# EAGLE design Yukari (EAGLE 6.2)
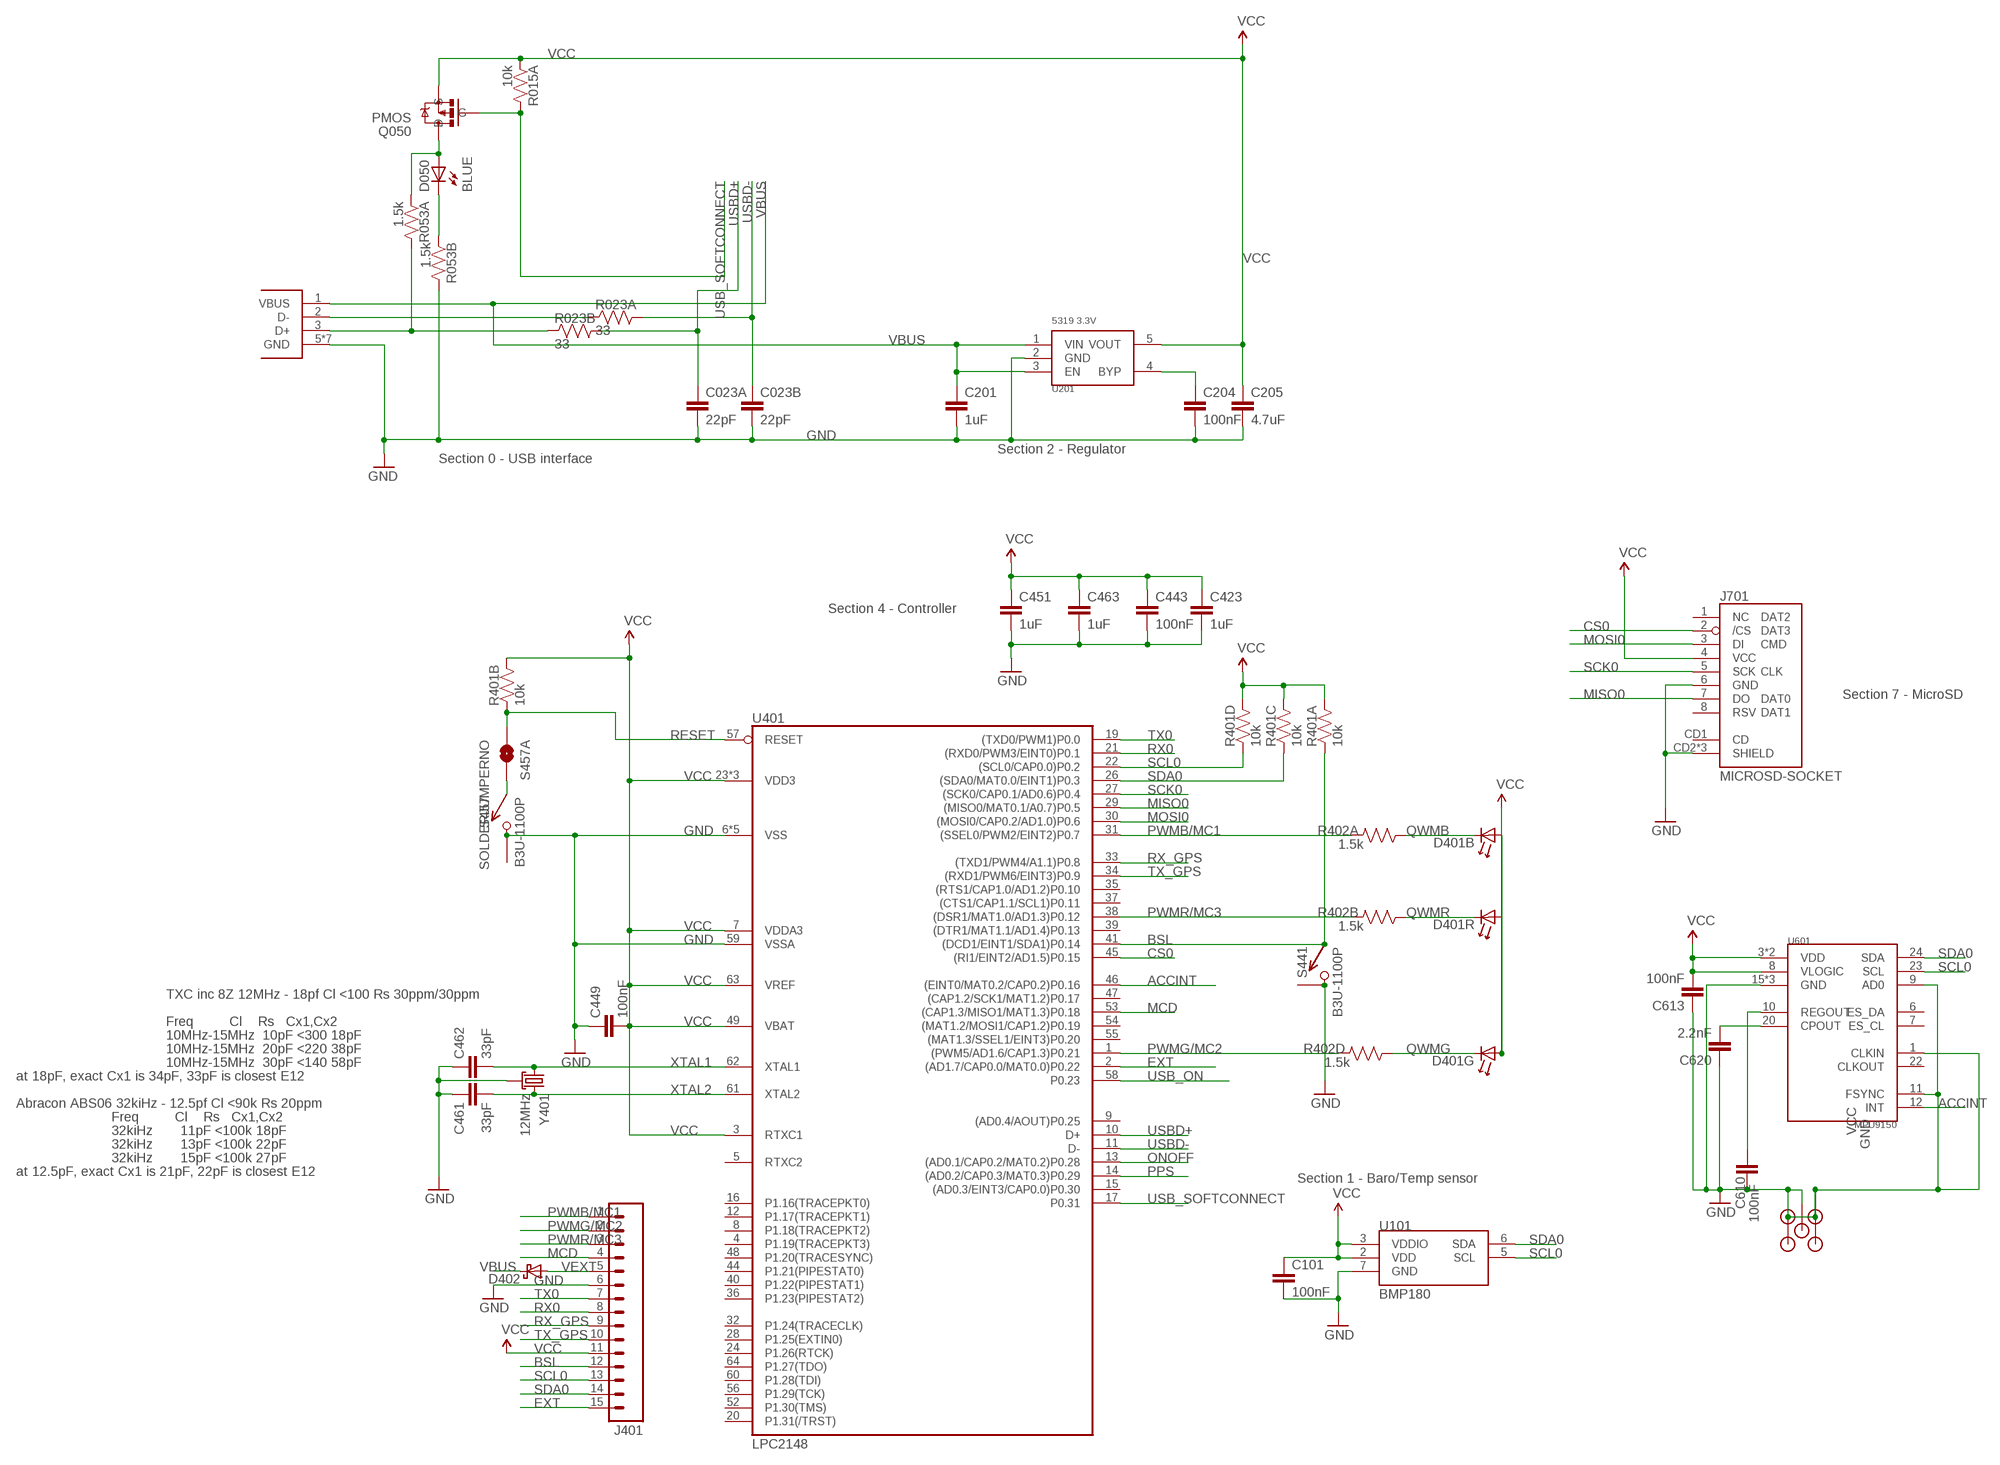
[diagram p0: schematic, sheet 1, part 1 of 2]
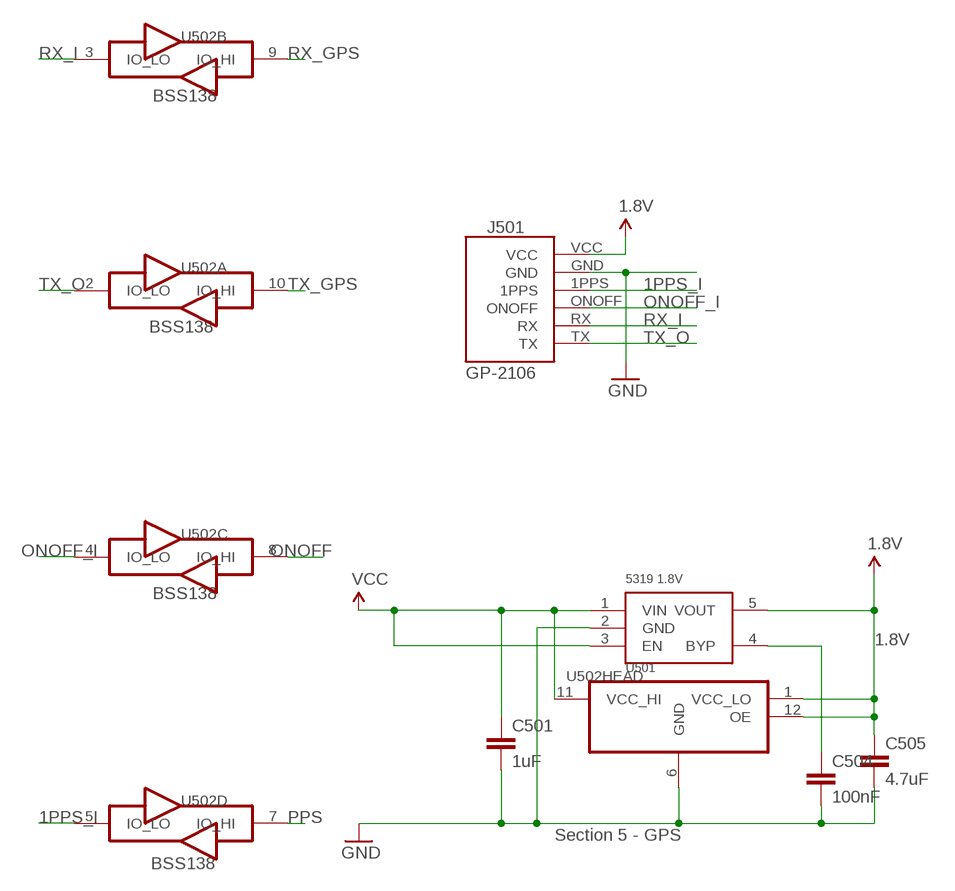
[diagram p1: schematic, sheet 1, part 2 of 2]

## Parts
C023  22pF  CKCM25  [CKCM25]
C101  100nF  CAP0402-CAP  [0402-CAP]
C201  1uF  CAP0402-CAP  [0402-CAP]
C204  100nF  CAP0402-CAP  [0402-CAP]
C205  4.7uF  CAP0402-CAP  [0402-CAP]
C423  1uF  CAP0402-CAP  [0402-CAP]
C443  100nF  CAP0402-CAP  [0402-CAP]
C449  100nF  CAP0402-CAP  [0402-CAP]
C451  1uF  CAP0402-CAP  [0402-CAP]
C461  33pF  CAP0402-CAP  [0402-CAP]
C462  33pF  CAP0402-CAP  [0402-CAP]
C463  1uF  CAP0402-CAP  [0402-CAP]
C501  1uF  CAP0402-CAP  [0402-CAP]
C504  100nF  CAP0402-CAP  [0402-CAP]
C505  4.7uF  CAP0402-CAP  [0402-CAP]
C610  100nF  CAP0402-CAP  [0402-CAP]
C613  100nF  CAP0402-CAP  [0402-CAP]
C620  2.2nF  CAP0402-CAP  [0402-CAP]
D050  BLUE  LED0603  [LED-0603]
D401  SMLP36RGB2W(R)  [SMLP36]
D402  DIODE_SCHOTTKY  [D0603]
J001  USB_MICROB_JSTGCT  [USB_MICROB_3075]
J401  M15  [1X15]
J501  GP-2106  [GP-2106]
J701  MICROSD-SOCKET  [MICROSD-SOCKET-PP]
JP1  STANDOFF  [STANDOFF]
JP2  STANDOFF  [STANDOFF]
JP3  STANDOFF  [STANDOFF]
JP4  STANDOFF  [STANDOFF]
JP5  STANDOFF  [STANDOFF]
Q050  PMOS  MOSFET_PCHANNELSC70  [SC-70-3]
R015  10k  RP2EXB24V  [CRA02]
R023  33  RP2EXB24V  [CRA02]
R053  1.5k  RP2EXB24V  [CRA02]
R401  10k  RP404  [CRA04]
R402  1.5k  RP404  [CRA04]
S441  B3U-1100P  [B3U-1100P]
S457  B3U-1100P  [B3U-1100P]
S457A  SOLDERJUMPERNO  [SJ_2S-NO]
U101  BMP180  [BMP180]
U201  5319 3.3V  MIC5319D5  [SOT-23-5]
U401  LPC2148  [LQFP64]
U501  5319 1.8V  MIC5319D5  [SOT-23-5]
U502  TXB0104RUT  [R-PUQFN-N12]
U601  MPU9150  [LLGA24]
Y401  12MHz  CX2520  [CRYSTAL_SMD_2MM_2_5MM]

## Nets
1.8V: C505.1 J501.VCC U501.5(VOUT) U502.1(HEAD:VCC_LO) U502.12(HEAD:OE)
1PPS_I: J501.1PPS U502.5(D:IO_LO)
ACCINT: U401.46((EINT0/MAT0.2/CAP0.2)P0.16) U601.12(INT)
BSL: J401.12 R401.1 S441.P$1 U401.41((DCD1/EINT1/SDA1)P0.14)
CONN_D+: J001.3(D+) R023.2 R053.4
CONN_D-: J001.2(D-) R023.1
CS0: J701.2(/CS) U401.45((RI1/EINT2/AD1.5)P0.15)
EXT: J401.15 U401.2((AD1.7/CAP0.0/MAT0.0)P0.22)
GND [power]: C023.3 C023.4 C101.2 C201.2 C204.2 C205.2 C423.2 C443.2 C449.1 C451.2 C461.1 C462.1 C463.2 C501.2 C504.2 C505.2 C610.2 C613.1 C620.1 J001.5(GND) J001.P$1(GND) J001.P$2(GND) J001.P$3(GND) J001.P$4(GND) J001.P$8(GND) J001.P$10(GND) J401.6 J501.GND J701.6(GND) J701.CD2(SHIELD) J701.GND1(SHIELD) J701.GND3(SHIELD) JP1.P$1 JP2.P$1 JP3.P$1 JP4.P$1 JP5.P$1 R053.3 S441.P$2 S441.P$3 S457.P$2 S457.P$3 U101.7(GND) U201.2(GND) U401.6(VSS) U401.18(VSS) U401.25(VSS) U401.42(VSS) U401.50(VSS) U401.59(VSSA) U501.2(GND) U502.6(HEAD:GND) U601.1(CLKIN) U601.9(AD0) U601.11(FSYNC) U601.15(GND) U601.17(GND) U601.18(GND) Y401.2(GND) Y401.4(GND)
MCD: J401.4 U401.53((CAP1.3/MISO1/MAT1.3)P0.18)
MISO0: J701.7(DO) U401.29((MISO0/MAT0.1/A0.7)P0.5)
MOSI0: J701.3(DI) U401.30((MOSI0/CAP0.2/AD1.0)P0.6)
N$1: C620.2 U601.20(CPOUT)
N$9 [power]: S457.P$1 S457A.2
N$12: C504.1 U501.4(BYP)
N$13: C610.1 U601.10(REGOUT)
N$17: C204.1 U201.4(BYP)
ONOFF: U401.13((AD0.1/CAP0.2/MAT0.2)P0.28) U502.8(C:IO_HI)
ONOFF_I: J501.ONOFF U502.4(C:IO_LO)
PPS: U401.14((AD0.2/CAP0.3/MAT0.3)P0.29) U502.7(D:IO_HI)
PWMB/MC1: J401.1 R402.8 U401.31((SSEL0/PWM2/EINT2)P0.7)
PWMG/MC2: J401.2 R402.5 U401.1((PWM5/AD1.6/CAP1.3)P0.21)
PWMR/MC3: J401.3 R402.7 U401.38((DSR1/MAT1.0/AD1.3)P0.12)
QWMB: D401.1(B:C) R402.1
QWMG: D401.5(G:C) R402.4
QWMR: D401.3(R:C) R402.2
RESET [power]: R401.2 S457A.1 U401.57(RESET)
RX0: J401.8 U401.21((RXD0/PWM3/EINT0)P0.1)
RX_GPS: J401.9 U401.33((TXD1/PWM4/A1.1)P0.8) U502.9(B:IO_HI)
RX_I: J501.RX U502.3(B:IO_LO)
SCK0: J701.5(SCK) U401.27((SCK0/CAP0.1/AD0.6)P0.4)
SCL0: J401.13 R401.4 U101.5(SCL) U401.22((SCL0/CAP0.0)P0.2) U601.23(SCL)
SDA0: J401.14 R401.3 U101.6(SDA) U401.26((SDA0/MAT0.0/EINT1)P0.3) U601.24(SDA)
TX0: J401.7 U401.19((TXD0/PWM1)P0.0)
TX_GPS: J401.10 U401.34((RXD1/PWM6/EINT3)P0.9) U502.10(A:IO_HI)
TX_O: J501.TX U502.2(A:IO_LO)
USB_CONNECT+: D050.A Q050.3(D) R053.1
USB_LED-: D050.C R053.2
USB_ON: U401.58(P0.23)
USB_SOFTCONNECT: Q050.1(G) R015.4 U401.17(P0.31)
USBD+: C023.1 R023.3 U401.10(D+)
USBD-: C023.2 R023.4 U401.11(D-)
VBUS [power]: C201.1 J001.1(VBUS) U201.1(VIN) U201.3(EN)
VCC [power]: C101.1 C205.1 C423.1 C443.1 C449.2 C451.1 C463.1 C501.1 C613.2 D401.2(B:A) D401.4(R:A) D401.6(G:A) J401.11 J701.4(VCC) Q050.2(S) R015.1 R401.5 R401.6 R401.7 R401.8 U101.2(VDD) U101.3(VDDIO) U201.5(VOUT) U401.3(RTXC1) U401.7(VDDA3) U401.23(VDD3) U401.43(VDD3) U401.49(VBAT) U401.51(VDD3) U401.63(VREF) U501.1(VIN) U501.3(EN) U502.11(HEAD:VCC_HI) U601.3(VDD) U601.8(VLOGIC) U601.13(VDD)
VEXT [power]: D402.A J401.5
XTAL1: C462.2 U401.62(XTAL1) Y401.1
XTAL2: C461.2 U401.61(XTAL2) Y401.3
Unconnected: D402.C(K) J701.1(NC) J701.8(RSV) J701.CD1(CD) R015.2 R015.3 R402.3 R402.6 U401.4(P1.19(TRACEPKT3)) U401.5(RTXC2) U401.8(P1.18(TRACEPKT2)) U401.9((AD0.4/AOUT)P0.25) U401.12(P1.17(TRACEPKT1)) U401.15((AD0.3/EINT3/CAP0.0)P0.30) U401.16(P1.16(TRACEPKT0)) U401.20(P1.31(/TRST)) U401.24(P1.26(RTCK)) U401.28(P1.25(EXTIN0)) U401.32(P1.24(TRACECLK)) U401.35((RTS1/CAP1.0/AD1.2)P0.10) U401.36(P1.23(PIPESTAT2)) U401.37((CTS1/CAP1.1/SCL1)P0.11) U401.39((DTR1/MAT1.1/AD1.4)P0.13) U401.40(P1.22(PIPESTAT1)) U401.44(P1.21(PIPESTAT0)) U401.47((CAP1.2/SCK1/MAT1.2)P0.17) U401.48(P1.20(TRACESYNC)) U401.52(P1.30(TMS)) U401.54((MAT1.2/MOSI1/CAP1.2)P0.19) U401.55((MAT1.3/SSEL1/EINT3)P0.20) U401.56(P1.29(TCK)) U401.60(P1.28(TDI)) U401.64(P1.27(TDO)) U601.6(ES_DA) U601.7(ES_CL) U601.22(CLKOUT)

## Notes on the sheet
- BSS138
- Section 0 - USB interface | Section 2 - Regulator
- BSS138
- Section 4 - Controller
- BSS138
- Section 7 - MicroSD
- Section 5 - GPS
- BSS138
- TXC inc 8Z 12MHz - 18pf Cl <100 Rs 30ppm/30ppm
- Freq         Cl    Rs   Cx1,Cx2
- 10MHz-15MHz  10pF <300 18pF
- 10MHz-15MHz  20pF <220 38pF
- 10MHz-15MHz  30pF <140 58pF
- at 18pF, exact Cx1 is 34pF, 33pF is closest E12
- Abracon ABS06 32kiHz - 12.5pf Cl <90k Rs 20ppm
- Freq         Cl    Rs   Cx1,Cx2
- 32kiHz       11pF <100k 18pF
- 32kiHz       13pF <100k 22pF
- 32kiHz       15pF <100k 27pF
- at 12.5pF, exact Cx1 is 21pF, 22pF is closest E12
- Section 1 - Baro/Temp sensor

## Library data of the parts
C023 = KwanSystems:CKC; DIGIKEY: 445-1860-1-ND
C101 C204 C443 C449 C504 C610 C613 = SparkFun:CAP: Capacitor Standard 0603 ceramic capacitor, and 0.1" leaded capacitor.; DIGIKEY: 445-1265-1-ND
C201 C423 C451 C463 C501 = SparkFun:CAP: Capacitor Standard 0603 ceramic capacitor, and 0.1" leaded capacitor.; DIGIKEY: 445-4114-1-ND
C205 C505 = SparkFun:CAP: Capacitor Standard 0603 ceramic capacitor, and 0.1" leaded capacitor.; DIGIKEY: 445-7395-1-ND
C461 C462 = SparkFun:CAP: Capacitor Standard 0603 ceramic capacitor, and 0.1" leaded capacitor.; DIGIKEY: 445-1241-1-ND
C620 = SparkFun:CAP: Capacitor Standard 0603 ceramic capacitor, and 0.1" leaded capacitor.; DIGIKEY: 445-1257-1-ND
D050 = SparkFun:LED: LEDs Standard schematic elements and footprints for 5mm, 3mm, 1206, and 0603 sized LEDs. 5mm - Spark Fun Electronics SKU : COM-00529 (and others); DIGIKEY: 350-2037-1-ND
D401 = KwanSystems:SMLP36RGB2W(R); DIGIKEY: 846-1097-1-ND
D402 = KwanSystems:DIODE_SCHOTTKY
J001 = KwanSystems:USB_MICROB_JST; DIGIKEY: 609-4616-2-ND
J401 = SparkFun-Connectors:M15: Header 15 Standard 15-pin 0.1" header. Use with straight break away headers (SKU : PRT-00116), right angle break away headers (PRT-00553), swiss pins (PRT-00743), machine pins (PRT-00117), and female headers (PRT-00115).; DIGIKEY: $NOPART
J501 = SparkFun:GP-2106: GP-2106 GPS SiRF IV
J701 = KwanSystems:MICROSD-SOCKET: microSD Socket Push-push type uSD socket. Digikey 101-00660-68-6-1-ND. tDoc lines correctly indicate media card edge positions when inserting (unlocked, locked, depressed).; DIGIKEY: 101-00581-59-1-ND
JP1-JP5 = KwanSystems:STANDOFF; DIGIKEY: $NOPART
Q050 = KwanSystems:MOSFET_PCHANNEL; DIGIKEY: NTR1P02T1GOSCT-ND
R015 = KwanSystems:RP2; DIGIKEY: Y5103CT-ND
R023 = KwanSystems:RP2
R053 = KwanSystems:RP2; DIGIKEY: CRA4S81.5KCT-ND
R401 = KwanSystems:RP4; DIGIKEY: CRA4S810KCT-ND
R402 = KwanSystems:RP4; DIGIKEY: CRA4S81.5KCT-ND
S441 S457 = KwanSystems:B3U-1100P; DIGIKEY: SW1021CT-ND
S457A = SparkFun-Passives:SOLDERJUMPER: Solder Jumper Standard SMD solder jumper. Used to automate production. Two varients : Normally Open and Normally Closed are the same, but have different paste layers. NC will have a large amount of paste and should jumper during reflow.; DIGIKEY: $NOPART
U101 = KwanSystems:BMP180; DIGIKEY: 828-1027-1-ND
U201 U501 = KwanSystems:MIC5319; DIGIKEY: 576-1910-1-ND
U401 = KwanSystems:LPC2148
U502 = KwanSystems:TXB0104
U601 = KwanSystems:MPU9150; DIGIKEY: $NOPART
Y401 = KwanSystems:CX2520; DIGIKEY: 887-1487-1-ND

## Net classes
0 default: width 0.152 mm, drill 0.33 mm, clearance 0.152 mm
1 power: width 0.152 mm, drill 0.33 mm, clearance 0.152 mm to class 0, clearance 0.152 mm
2 hv: width 0.152 mm, drill 0.33 mm, clearance 0.152 mm to class 0, clearance 0.152 mm to class 1, clearance 0.152 mm

## Board
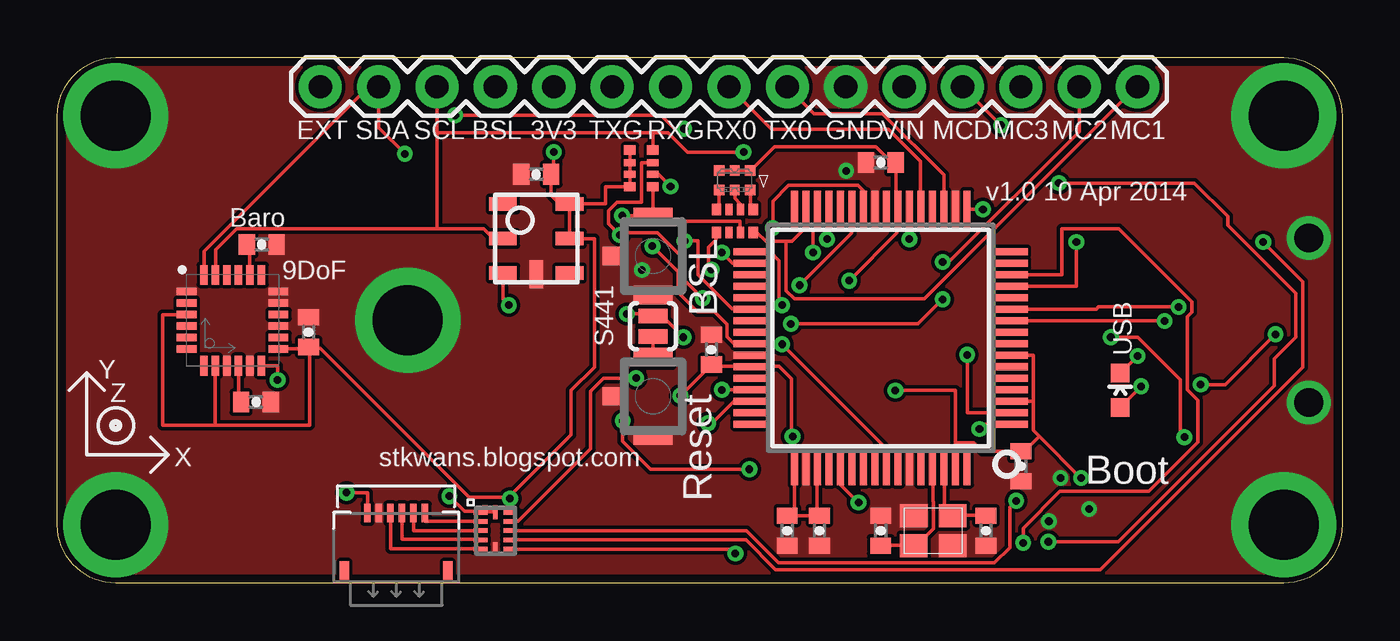
[diagram p2: board, top side]
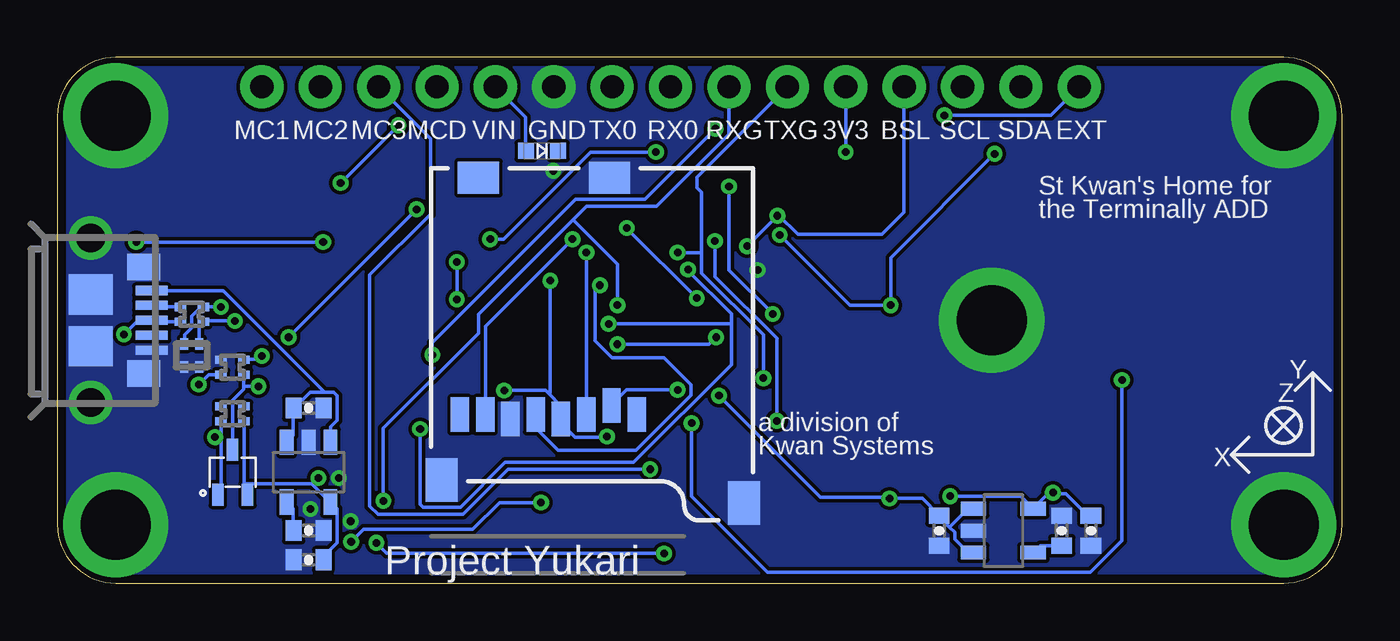
[diagram p3: board, bottom side, seen from below]

Size 55.88 x 22.86 mm. Coordinates in mm from the lower left corner, seen from the top.
Outline: 2.54,22.86 53.34,22.86 arc-90 55.88,20.32 55.88,2.54 arc-90 53.34,0 2.54,0 arc-90 0,2.54 0,20.32 arc-90 2.54,22.86
Copper layers (1*16): Top 0.0356mm / dielectric 1.5011mm / Bottom 0.0356mm
Design rules: minimum track width 6mil, minimum drill 13mil, track to track 6mil, track to pad 6mil, pad to pad 6mil, via to via 6mil, smd to smd 6mil, copper to edge 15mil, drill to drill 6mil, minimum pad ring 7mil, minimum via ring 7mil, stop-mask expansion 4mil, vias tented up to drill 14mil, thermal gap 10mil

### Footprints (pad centres in the part's own frame; a part is rotated, then mirrored left to right if it is on the bottom)
CKCM25 = smd 0.35 x 0.5: 1 -0.325,-0.5; 2 0.325,-0.5; 3 0.325,0.5; 4 -0.325,0.5
0402-CAP = smd 0.7 x 0.9: 1 -0.65,0; 2 0.65,0
LED-0603 = smd 0.8 x 0.8: A 0,-0.75; C 0,0.75
SMLP36 = smd 0.45 x 0.45: 1 -0.675,0.425; 2 -0.675,-0.425; 5 0.675,0.425; 6 0.675,-0.425 | smd 0.4 x 0.45: 3 0,0.425; 4 0,-0.425
D0603 = smd 0.7 x 0.7: A -0.7,0; C 0.7,0
USB_MICROB_3075 = smd 0.4 x 1.4: 1 -1.3,4.1; 2 -0.65,4.1; 3 0,4.1; 4 0.65,4.1; 5 1.3,4.1 | smd 1.15 x 1.45: P$1 2.32,3.75; P$10 -2.32,3.75 | smd 1.75 x 1.9: P$2 1.125,1.45; P$8 -1.125,1.45 | drill 1.25 pad 1.9: P$3 -3.575,1.45; P$4 3.575,1.45
1X15 = drill 1.016 pad 1.88: 1 0,0; 2 2.54,0; 3 5.08,0; 4 7.62,0; 5 10.16,0; 6 12.7,0; 7 15.24,0; 8 17.78,0; 9 20.32,0; 10 22.86,0; 11 25.4,0; 12 27.94,0; 13 30.48,0; 14 33.02,0; 15 35.56,0
GP-2106 = smd 0.3 x 0.8: 1PPS -0.25,0; GND -0.75,0; ONOFF 0.25,0; RX 0.75,0; TX 1.25,0; VCC -1.25,0 | smd 0.4 x 0.8: P$7 -2.25,-2.5; P$8 2.25,-2.5
MICROSD-SOCKET-PP = smd 0.8 x 1.5: 1 -8.94,10.7; 2 -7.84,10.3; 3 -6.74,10.7; 4 -5.64,10.9; 5 -4.54,10.7; 6 -3.44,10.9; 7 -2.34,10.7; 8 -1.24,10.7 | smd 1.8 x 1.4: CD1 -2.05,0.4; CD2 -7.75,0.4 | smd 1.4 x 1.9: GND1 -13.6,14.55; GND3 -0.45,13.55
STANDOFF = drill 3.048 pad 4.572: P$1 0,0
SC-70-3 = smd 0.5 x 0.95: 1 -0.65,-0.975; 2 0.65,-0.975; 3 0,0.975
CRA02 = smd 0.35 x 0.5: 1 -0.325,-0.5; 2 0.325,-0.5; 3 0.325,0.5; 4 -0.325,0.5
CRA04 = smd 0.4 x 0.5: 1 -0.8,-0.5; 4 0.8,-0.5; 5 0.8,0.5; 8 -0.8,0.5 | smd 0.3 x 0.5: 2 -0.25,-0.5; 3 0.25,-0.5; 6 0.25,0.5; 7 -0.25,0.5
B3U-1100P = smd 0.8 x 1.7: P$1 -1.7,0; P$2 1.7,0 | smd 0.8 x 1.1: P$3 0,-1.65
SJ_2S-NO = smd 0.635 x 1.27: 1 -0.45,0; 2 0.45,0
BMP180 = smd 0.6 x 1.2: 1 1.5,1.45; 2 0,1.45; 3 -1.5,1.45; 4 -1.5,-1.45; 5 0,-1.45; 6 1.5,-1.45 | smd 1.2 x 0.6: 7 1.55,0
SOT-23-5 = smd 0.6 x 1.1: 1 -0.95,-1.3; 2 0,-1.3; 3 0.95,-1.3; 4 0.95,1.3; 5 -0.95,1.3
LQFP64 = smd 0.3 x 1.6: 1 -3.75,-5.6; 2 -3.25,-5.6; 3 -2.75,-5.6; 4 -2.25,-5.6; 5 -1.75,-5.6; 6 -1.25,-5.6; 7 -0.75,-5.6; 8 -0.25,-5.6; 9 0.25,-5.6; 10 0.75,-5.6; 11 1.25,-5.6; 12 1.75,-5.6; 13 2.25,-5.6; 14 2.75,-5.6; 15 3.25,-5.6; 16 3.75,-5.6; 33 3.75,5.6; 34 3.25,5.6; 35 2.75,5.6; 36 2.25,5.6; 37 1.75,5.6; 38 1.25,5.6; 39 0.75,5.6; 40 0.25,5.6; 41 -0.25,5.6; 42 -0.75,5.6; 43 -1.25,5.6; 44 -1.75,5.6; 45 -2.25,5.6; 46 -2.75,5.6; 47 -3.25,5.6; 48 -3.75,5.6 | smd 1.6 x 0.3: 17 5.6,-3.75; 18 5.6,-3.25; 19 5.6,-2.75; 20 5.6,-2.25; 21 5.6,-1.75; 22 5.6,-1.25; 23 5.6,-0.75; 24 5.6,-0.25; 25 5.6,0.25; 26 5.6,0.75; 27 5.6,1.25; 28 5.6,1.75; 29 5.6,2.25; 30 5.6,2.75; 31 5.6,3.25; 32 5.6,3.75; 49 -5.6,3.75; 50 -5.6,3.25; 51 -5.6,2.75; 52 -5.6,2.25; 53 -5.6,1.75; 54 -5.6,1.25; 55 -5.6,0.75; 56 -5.6,0.25; 57 -5.6,-0.25; 58 -5.6,-0.75; 59 -5.6,-1.25; 60 -5.6,-1.75; 61 -5.6,-2.25; 62 -5.6,-2.75; 63 -5.6,-3.25; 64 -5.6,-3.75
R-PUQFN-N12 = smd 0.2 x 0.6: 1 -0.8,-0.65; 2 -0.4,-0.65; 3 0,-0.65; 4 0.4,-0.65; 5 0.8,-0.65; 7 0.8,0.65; 8 0.4,0.65; 9 0,0.65; 10 -0.4,0.65; 11 -0.8,0.65 | smd 0.6 x 0.2: 6 0.8,0; 12 -0.8,0
LLGA24 = smd 0.85 x 0.34: 1 -2,1.25; 2 -2,0.75; 3 -2,0.25; 4 -2,-0.25; 5 -2,-0.75; 6 -2,-1.25; 13 2,-1.25; 14 2,-0.75; 15 2,-0.25; 16 2,0.25; 17 2,0.75; 18 2,1.25 | smd 0.34 x 0.85: 7 -1.25,-1.975; 8 -0.75,-1.975; 9 -0.25,-1.975; 10 0.25,-1.975; 11 0.75,-1.975; 12 1.25,-1.975; 19 1.25,1.975; 20 0.75,1.975; 21 0.25,1.975; 22 -0.25,1.975; 23 -0.75,1.975; 24 -1.25,1.975
CRYSTAL_SMD_2MM_2_5MM = smd 1.2 x 1: 1 -0.85,-0.65; 2 0.85,-0.65; 3 0.85,0.65; 4 -0.85,0.65

### Placement (x,y rotation side)
C023  50.04,9.91 180 bottom
C101  20.83,17.78 180 top
C201  44.96,7.62 0 bottom
C204  44.96,2.29 0 bottom
C205  44.96,1.02 180 bottom
C423  35.81,18.29 180 top
C443  28.45,10.16 90 top
C449  31.75,2.29 90 top
C451  33.15,2.29 270 top
C461  35.81,2.29 270 top
C462  40.39,2.29 90 top
C463  41.91,5.08 270 top
C501  17.53,2.29 270 bottom
C504  12.19,2.29 90 bottom
C505  10.92,2.29 270 bottom
C610  8.64,7.87 0 top
C613  10.92,10.92 270 top
C620  8.89,14.73 180 top
D050  46.23,8.38 0 top
D401  29.46,17.53 180 top
D402  34.8,18.8 0 bottom
J001  55.88,11.43 270 bottom
J401  46.99,21.59 180 top
J501  14.73,3.05 0 top
J701  39.62,18.03 180 bottom
JP1  2.54,2.54 0 top
JP2  2.54,20.32 0 top
JP3  15.24,11.43 0 top
JP4  53.34,2.54 0 top
JP5  53.34,20.32 0 top
Q050  48.26,4.83 0 bottom
R015  48.26,7.37 90 bottom
R023  50.04,11.68 270 bottom
R053  48.26,9.4 90 bottom
R401  25.4,18.03 90 top
R402  29.46,15.75 180 top
S441  25.91,14.22 270 top
S457  25.91,8.13 270 top
S457A  25.91,11.18 270 top
U101  20.83,14.99 270 top
U201  44.96,4.83 180 bottom
U401  35.81,10.67 90 top
U501  14.73,2.29 270 bottom
U502  19.05,2.29 270 top
U601  7.62,11.43 0 top
U$4  [AXES]  1.27,5.59 0 top
Y401  38.1,2.29 180 top

### Tracks (layer width: path | path; a pad name or v marks a point on that pad's centre or on a via)
1.8V  (via drill 0.33)
  Top 0.152: U502.12 18.41,3.1 U502.1 18.34,3.12 17.7,3.12 v17.04,3.79 | J501.VCC 13.48,3.94 v12.57,3.94
  Bottom 0.152: v17.04,3.79 13.97,3.79 13.44,3.25 U501.5 13.39,3.3 12.75,3.94 v12.57,3.94 12.52,3.89 12.01,3.89 11.07,2.95 C505.1
1PPS_I
  Top 0.152: U502.5 14.48,1.5 J501.1PPS
ACCINT  (via drill 0.33)
  Top 0.152: 8.97,9.45 8.89,9.45 U601.12 9.58,9.46 v9.58,8.84 | v28.3,6.96 28.47,6.96 29.41,7.9 30.2,7.9 U401.46
  Bottom 0.152: v9.58,8.84 9.58,1.85 10.95,0.48 24.99,0.48 28.3,3.79 v28.3,6.96
BSL  (via drill 0.33)
  Top 0.152: R401.1 S441.P$1 25.86,15.98 v24.56,15.98 | v25.88,14.66 27,13.54 27,12.65 27.84,11.81 28.57,11.81 29.13,11.25 29.13,10.72 29.41,10.44 30.2,10.44 U401.41
  Bottom 0.152: v25.88,14.66 v24.56,15.98 24.51,16 23.67,15.16 20.02,15.16 19.05,16.13 J401.12
CONN_D+  (via drill 0.33)
  Top 0.152: v49.73,8.64 50.8,8.64 v52.98,10.82
  Bottom 0.152: v49.73,8.64 49.3,9.07 R053.4 | v52.98,10.82 52.38,11.43 J001.3 51.74,11.38 50.55,11.38 R023.2
CONN_D-
  Bottom 0.152: R023.1 51.71,12.01 51.77,12.06 J001.2
CS0  (via drill 0.33)
  Top 0.152: v28.91,8.41 30.2,8.41 U401.45
  Bottom 0.152: v28.91,8.41 31.11,8.41 31.77,7.75 J701.2
EXT  (via drill 0.33)
  Top 0.152: v27.25,19.76 26.85,19.76 26.26,20.34 v17.3,20.34 | U401.2 39.57,7.42 v39.57,9.93
  Bottom 0.152: v27.25,19.76 30.33,16.69 33.35,16.69 39.57,10.46 v39.57,9.93 | v17.3,20.34 12.68,20.34 J401.15
GND  (via drill 0.33)
  other vias: 43.64,4.57 44.88,3.23 43.13,2.69 34.32,17.93 25.43,13.61
  pour Top (no thermals): 2.54,22.86 53.34,22.86 55.88,22.86 55.88,2.54 arc-90 53.34,0 2.54,0 arc-90 0,2.54 0,20.32 arc-90
  pour Bottom (no thermals): 2.54,22.86 53.34,22.86 55.88,22.86 55.88,2.54 arc-90 53.34,0 2.54,0 arc-90 0,2.54 0,20.32 arc-90
MCD  (via drill 0.33)
  Top 0.152: v34.85,3.5 34.09,4.27 34.09,5.05 U401.53 | v43.1,1.8 46.15,1.8 52.93,8.59 52.93,9.75 53.87,10.69 53.87,12.6 50.9,15.57 50.9,15.95 49.45,17.4 v43.56,17.4 | J401.4 v41.05,19.91
  Bottom 0.152: v34.85,3.5 36.65,3.5 37.82,2.34 42.57,2.34 v43.1,1.8 | v41.05,19.91 v43.56,17.4
MISO0  (via drill 0.33)
  Top 0.152: v33.48,14.96 33.48,16.18 33.55,16.26 U401.29
  Bottom 0.152: v33.48,14.96 37.26,11.18 37.26,7.34 J701.7
MOSI0  (via drill 0.33)
  Top 0.152: v32.87,14.38 32.87,15.29 33.05,15.47 33.05,16.26 U401.30
  Bottom 0.152: v32.87,14.38 32.87,7.34 J701.3
N$1
  Top 0.152: U601.20 8.36,13.41 8.36,14.63 8.26,14.73 C620.2
N$9
  Top 0.152: S457.P$1 S457A.2
N$12
  Bottom 0.152: C504.1 12.19,1.63 13.13,1.63 13.41,1.35 U501.4
N$13
  Top 0.152: U601.10 7.87,7.98 7.98,7.87 C610.1
N$17
  Bottom 0.152: C204.1 45.62,3.23 45.9,3.5 U201.4
ONOFF  (via drill 0.33)
  Top 0.152: v52.45,14.83 54.18,13.11 54.18,9.4 45.36,0.58 31.24,0.58 29.95,1.88 U502.8 | U401.13 44.32,12.92 v44.32,14.83
  Bottom 0.152: v44.32,14.83 v52.45,14.83
ONOFF_I
  Top 0.152: U502.4 18.39,1.91 14.98,1.91 J501.ONOFF
PPS  (via drill 0.33)
  Top 0.152: v29.49,1.29 29.31,1.47 19.71,1.47 U502.7 | v42.01,1.75 42.01,2.39 43.61,3.99 47.47,3.99 49.61,6.12 49.61,7.95 49.15,8.41 49.15,11.58 49.35,11.79 49.35,12.24 46.18,15.42 43.69,15.42 43.69,13.42 U401.14
  Bottom 0.152: v29.49,1.29 41.55,1.29 v42.01,1.75
PWMB/MC1
  Top 0.152: 31.7,14.86 31.95,14.86 32.56,15.47 32.56,16.26 U401.31 | 31.7,14.86 30.81,14.86 30.43,15.24 30.28,15.24 R402.8 | 31.7,14.86 31.7,12.72 32.05,12.37 37.72,12.37 46.94,21.59 J401.1
PWMG/MC2  (via drill 0.33)
  Top 0.152: v28.45,13.64 28.32,13.77 28.32,14.61 28.65,14.94 R402.5 | U401.1 40.32,6.92 v40.11,6.71 | J401.2 44.45,19.63 38.79,13.97 v38.51,13.97 | v31.9,11.28 37.44,11.28 v38.51,12.34
  Bottom 0.152: v28.45,13.64 28.45,13.59 26.57,11.71 26.57,11.28 | 26.57,11.28 26.57,9.5 30.81,5.26 36.4,5.26 38.35,3.3 39.98,3.3 40.11,3.43 v40.11,6.71 | v38.51,12.34 v38.51,13.97 | 26.57,11.28 v31.9,11.28
PWMR/MC3  (via drill 0.33)
  Top 0.152: R402.7 29.69,15.27 29.69,15.75 27.28,15.75 v27.28,14.88 27.86,14.88 27.86,13.41 29.34,11.94 30.2,11.94 U401.38 | v24.59,7.06 24.59,6.17 25.81,4.95 v30.1,4.95
  Bottom 0.152: v27.28,14.88 27.28,13.34 24.59,10.64 v24.59,7.06 | v30.1,4.95 36.27,4.95 38.23,3 41.94,3 42.29,3.35 42.29,13.41 39.65,16.05 39.65,19.33 J401.3
QWMB
  Top 0.152: D401.1 30.15,16.36 R402.1
QWMG
  Top 0.152: D401.5 28.78,17.09 28.78,16.36 28.68,16.26 R402.4
QWMR
  Top 0.152: D401.3 29.46,16.74 29.69,16.51 29.69,16.26 R402.2
RESET  (via drill 0.33)
  Top 0.152: v26.67,17.25 26.14,17.78 R401.2 | v24.77,11.71 25.83,11.71 S457A.1 25.96,11.58 26.34,11.58 v27.23,10.69 | v31.52,10.39 36.04,5.87 36.04,5.08 U401.57
  Bottom 0.152: v26.67,17.25 26.67,13.61 v24.77,11.71 | v31.52,10.39 27.53,10.39 v27.23,10.69
RX0
  Top 0.152: J401.8 31.06,19.74 36.14,19.74 37.54,18.34 37.54,16.28 U401.21
RX_GPS  (via drill 0.33)
  Top 0.152: U502.9 29.97,2.29 31.37,0.89 40.77,0.89 41.43,1.55 41.43,3.3 v41.71,3.58 | v31.52,12.09 31.39,12.22 31.39,14.02 31.01,14.4 30.23,14.4 U401.33
  Bottom 0.152: v41.71,3.58 41.71,6.73 37.57,10.87 37.57,11.68 33.45,15.8 | 33.45,15.8 32.87,16.38 29.82,16.38 26.67,19.53 J401.9 | v31.52,12.09 31.52,13.87 33.45,15.8
RX_I
  Top 0.152: U502.3 15.48,2.29 J501.RX
SCK0  (via drill 0.33)
  Top 0.152: v32.28,12.95 34.54,15.21 34.54,16.26 U401.27
  Bottom 0.152: v32.28,12.95 32.49,12.75 32.49,10.54 31.75,9.8 29.49,9.8 28.32,8.64 28.32,8.18 30.71,5.79 34.11,5.79 35.05,6.73 35.05,7.32 J701.5
SCL0  (via drill 0.33)
  Top 0.152: R401.4 25.91,19.58 | U101.5 18.97,14.99 18.54,15.42 16.51,15.42 | U601.23 6.88,13.41 6.88,14.5 7.8,15.42 15.24,15.42 16.51,15.42 | v37.06,14.96 37.06,16.26 U401.22 | v29.84,18.75 27.41,18.75 26.57,19.58 25.91,19.58 | 16.51,19.58 25.91,19.58 | 16.51,19.58 J401.13 | 16.51,19.58 16.51,15.42
  Bottom 0.152: v37.06,14.96 36.47,14.96 32.69,18.75 v29.84,18.75
SDA0  (via drill 0.33)
  Top 0.152: U601.24 6.38,14.43 13.54,21.59 J401.14 13.97,19.81 v15.11,18.67 | U101.6 19.38,13.46 19.38,12.34 v19.63,12.09 | v31.11,15.44 31.11,16.61 31.8,17.3 34.82,17.3 35.05,17.07 U401.26 | v28.07,12.39 27.3,13.16 27.3,14.05 26.11,15.24 24.46,15.24 v24.46,15.14 23.98,15.62 23.98,16.2 24.33,16.56 25.4,16.56 25.4,18.29 25.4,18.28 R401.3
  Bottom 0.152: v28.07,12.39 v31.11,15.44 | v24.46,15.14 21.41,12.09 v19.63,12.09 19.63,14.15 v15.11,18.67
TX0
  Top 0.152: J401.7 32.92,20.42 35.89,20.42 38.56,17.75 U401.19
TX_GPS  (via drill 0.33)
  Top 0.152: v25.17,8.91 23.75,8.91 23.19,8.36 23.19,5.84 20.04,2.69 U502.10 | v28.91,14.38 29.36,13.92 U401.34
  Bottom 0.152: v25.17,8.91 25.17,10.79 27.86,13.49 27.86,14.38 | 27.86,14.38 27.86,16.99 28.07,17.2 28.07,17.65 J401.10 | 27.86,14.38 v28.91,14.38
TX_O
  Top 0.152: U502.2 15.98,2.69 J501.TX
USB_CONNECT+  (via drill 0.33)
  Top 0.152: v47.14,8.56 46.23,7.64 D050.A
  Bottom 0.152: 47.78,8.56 47.78,8.43 48.26,7.95 Q050.3 | 47.78,8.56 47.78,9.07 R053.1 | 47.78,8.56 v47.14,8.56
USB_LED-  (via drill 0.33)
  Top 0.152: v46.99,9.88 46.23,9.12 D050.C
  Bottom 0.152: v46.99,9.88 47.14,9.73 R053.2
USB_SOFTCONNECT  (via drill 0.33)
  Top 0.152: v40.26,16.26 39.57,16.26 U401.17 | v45.82,10.69 46.99,10.69 48.84,8.84 48.84,6.53 v49.02,6.35
  Bottom 0.152: 48.77,6.35 48.77,3.99 48.9,3.86 Q050.1 | 48.77,6.35 R015.4 | v45.82,10.69 v40.26,16.26 | 48.77,6.35 v49.02,6.35
USBD+  (via drill 0.33)
  Top 0.152: v48.16,11.4 41.43,11.4 U401.10
  Bottom 0.152: C023.1 49.71,11.2 49.55,11.35 R023.3 49.48,11.4 v48.16,11.4
USBD-  (via drill 0.33)
  Top 0.152: v48.77,12.01 45.29,12.01 45.19,11.92 U401.11
  Bottom 0.152: C023.2 50.34,10.41 50.34,10.79 50.04,11.1 50.04,11.61 49.66,11.99 49.55,11.99 R023.4 49.48,12.01 v48.77,12.01
VBUS
  Bottom 0.152: U201.3 45.9,6.15 45.62,6.43 C201.1 45.54,7.64 44.88,8.31 44.3,8.31 | 44.3,8.31 43.87,8.31 43.71,8.15 43.71,7.09 43.99,6.81 43.99,6.15 U201.1 | J001.1 51.77,12.72 48.67,12.72 44.3,8.36 44.3,8.31
VCC  (via drill 0.33)
  Top 0.152: C101.1 | 22.28,16.51 U101.3 | U101.3 22.28,16.43 U101.2 23.37,14.99 23.37,9.4 22.35,8.38 22.35,6.45 19.63,3.73 | R401.8 24.92,17.25 24.92,17.78 R401.7 24.92,17.86 24.92,18.26 R401.6 24.92,18.34 24.92,18.82 R401.5 24.97,18.87 | 28.73,17.98 D401.6 28.8,17.96 D401.4 29.52,17.96 30.12,17.96 D401.2 30.2,17.98 31.19,18.97 35.61,18.97 36.27,18.31 36.4,18.31 C423.1 36.47,18.29 36.47,16.36 U401.23 36.52,16.2 36.52,15.24 v34.44,13.16 | U101.3 22.35,16.51 23.85,16.51 23.85,17.23 R401.8 | U502.11 19.68,3.1 v19.68,3.68 19.63,3.73 | U601.13 10.85,10.19 C613.2 10.97,10.21 | 19.63,3.73 17.91,3.73 11.43,10.21 10.97,10.21 | C451.1 | C451.1 33.05,3 33.05,5.05 U401.51 33.05,5.13 | C443.1 | U401.49 | 42.44,7.92 42.44,6.66 42.71,6.39 | 42.44,7.92 42.44,9.91 41.43,9.91 U401.7 | v44.53,4.57 42.71,6.39 | v27.1,8.15 28.4,9.45 C443.1 | C449.2 32.06,2.94 | 32.06,2.94 U401.49 | 24.57,17.23 R401.8 | 10.97,10.21 10.97,6.86 6.86,6.86 | 6.86,6.86 6.86,9.46 U601.8 | U601.3 4.57,11.68 4.57,6.86 6.86,6.86 | v21.59,18.75 21.59,17.78 C101.1 | C101.1 21.48,16.88 21.87,16.49 U101.3 | 32.06,2.94 C451.1 | U401.49 32.06,6.29 v31.98,6.38 31.93,6.43 31.93,8.89 31.39,9.42 30.23,9.42 | 30.23,9.42 28.45,9.42 C443.1 | U401.43 30.23,9.42 | U401.3 42.44,7.92 | v36.45,8.38 39.06,8.38 39.06,6.1 | 39.06,6.1 U401.63 | 42.71,6.39 42.05,5.73 C463.1 40.24,5.73 39.87,6.1 39.06,6.1
  Bottom 0.152: v21.59,18.75 J401.11 | 17.07,2.44 17.5,2.87 C501.1 18.26,3.68 v19.68,3.68 19.74,3.73 22.68,3.73 v27.1,8.15 | 17.07,2.44 16.84,2.21 16.84,1.91 16.28,1.35 16.05,1.35 U501.3 | 17.07,2.44 16.28,3.23 16.05,3.23 U501.1 | v31.98,6.38 32,6.35 33.38,6.35 33.96,6.93 33.96,7.11 J701.4 34.01,7.19 34.01,7.75 34.49,8.23 | R015.1 47.75,3.99 47.62,3.86 Q050.2 47.7,4.32 44.83,4.32 44.81,4.29 | C205.1 44.3,1.02 44.3,1.17 43.71,1.75 43.71,3.23 43.99,3.5 U201.5 44.07,3.56 44.81,4.29 | 44.81,4.29 v44.53,4.57 | 34.49,8.23 34.65,8.38 v36.45,8.38 | v34.44,13.16 34.44,8.28 34.49,8.23
VEXT
  Bottom 0.152: J401.5 35.51,20.27 D402.A
XTAL1
  Top 0.152: C462.2 38.96,2.95 Y401.1 38.94,3.02 38.58,3.38 38.58,5.05 U401.62
XTAL2
  Top 0.152: C461.2 35.81,1.65 37.24,1.65 Y401.3 37.31,1.68 37.41,1.68 38.1,2.36 38.1,3.53 38.08,3.56 38.08,5.05 U401.61

### Text on the board
tPlace: EXT | SDA | SCL | BSL | 3V3 | TXG | RXG | RX0 | TX0 | GND | VIN | MCD | MC3 | MC2 | MC1 | v1.0 10 Apr 2014 | Baro | BSL | 9DoF | USB | stkwans.blogspot.com | Reset | Boot
bPlace: EXT | SDA | SCL | BSL | 3V3 | TXG | RXG | RX0 | TX0 | GND | VIN | MCD | MC3 | MC2 | MC1 | St Kwan's Home for | the Terminally ADD | a division of | Kwan Systems | Project Yukari